# EAGLE design Zio nRF52840 Dev Board (EAGLE 9.2.2)
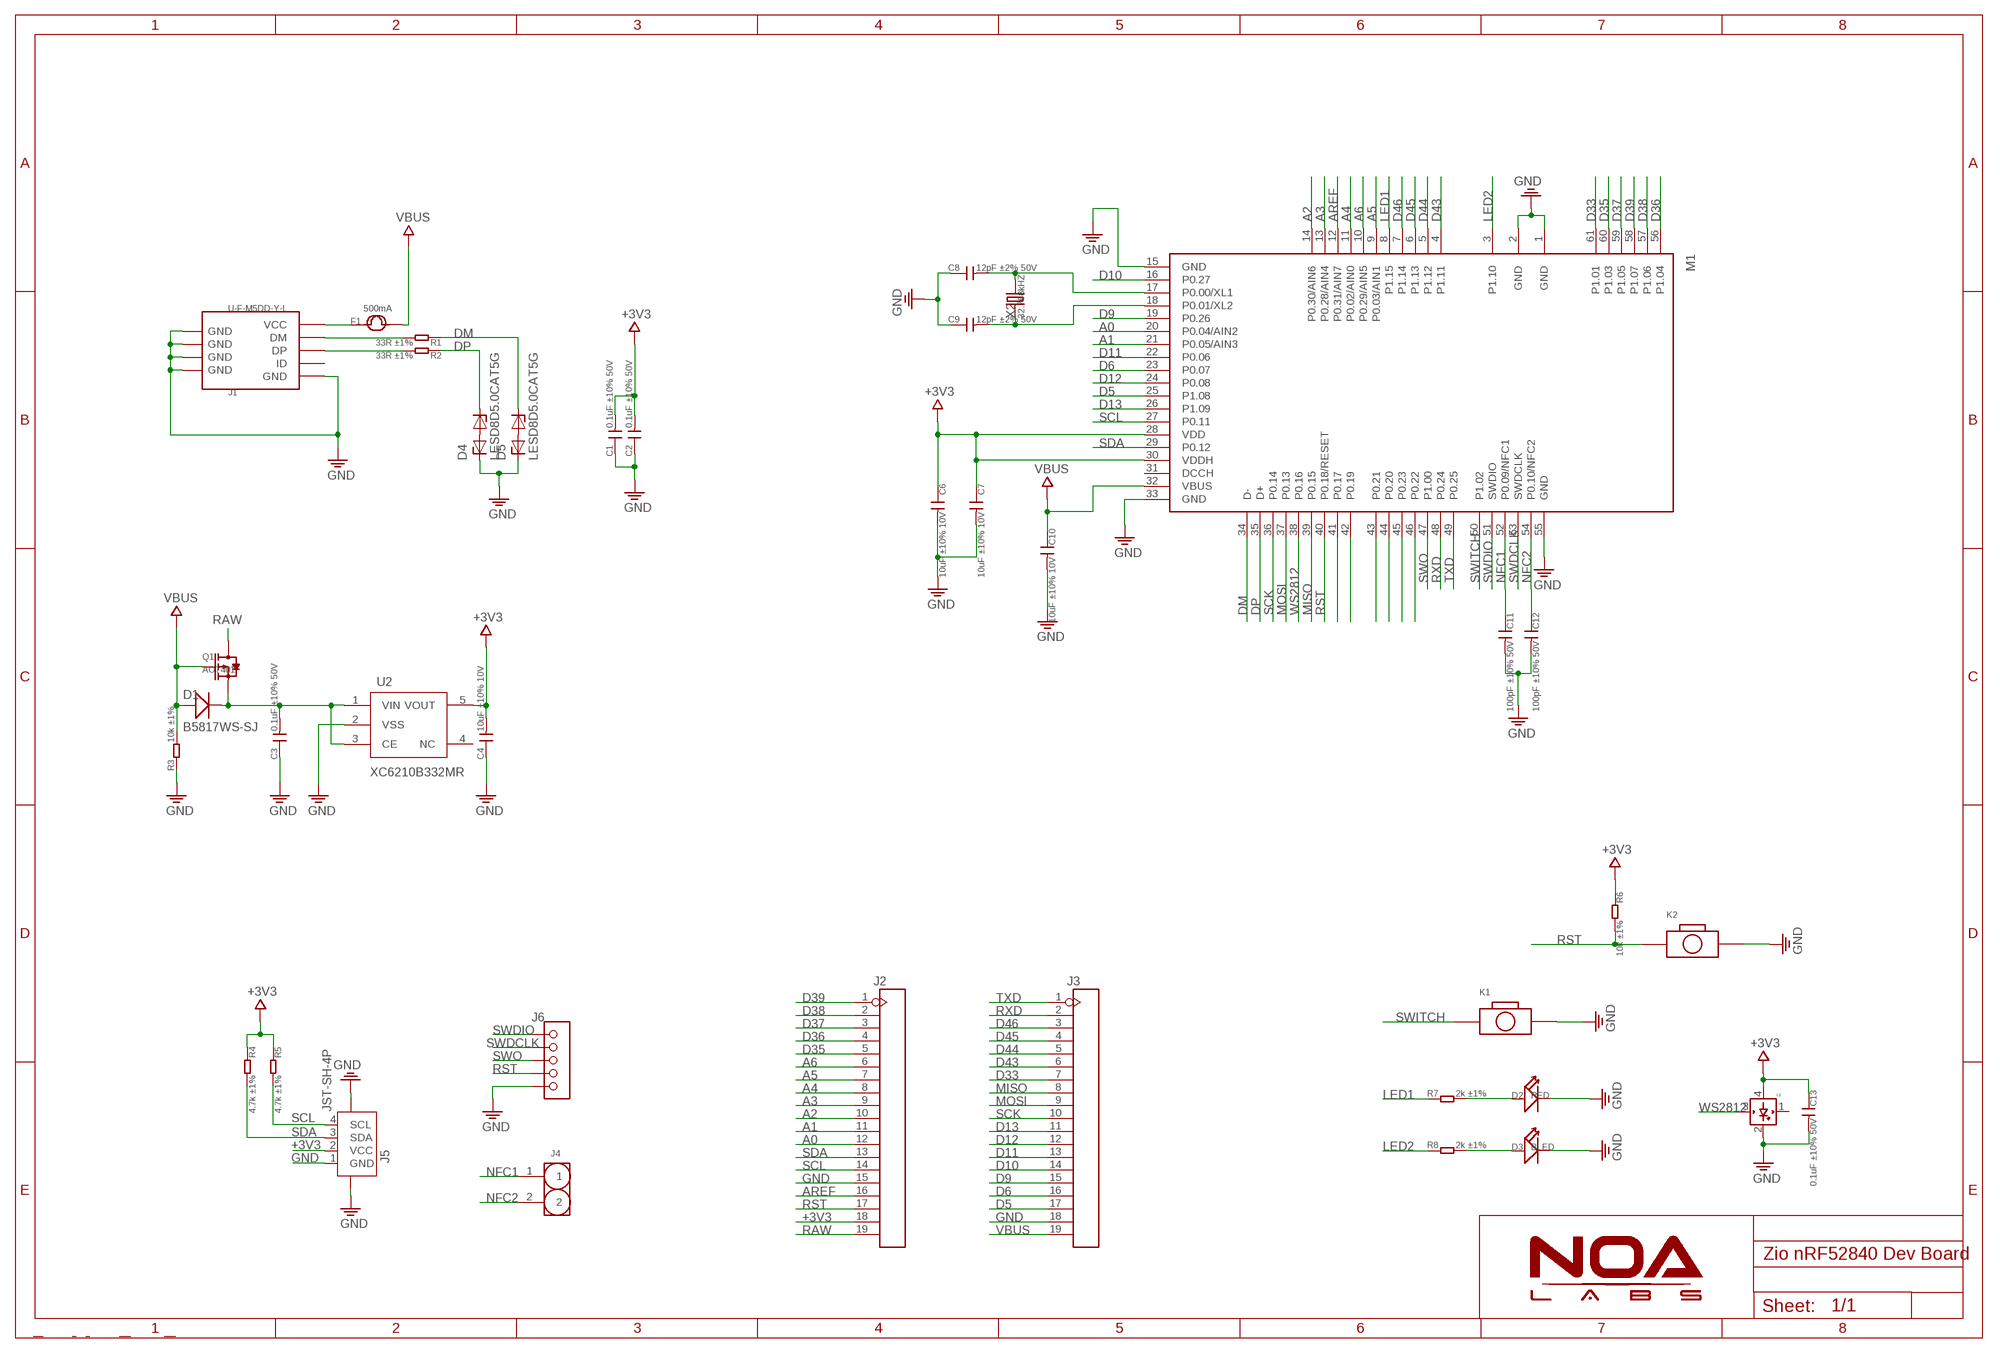
[diagram p0: schematic, sheet 1]

## Parts
C1  0.1uF ±10% 50V  C-0402  [C0402]
C2  0.1uF ±10% 50V  C-0402  [C0402]
C3  0.1uF ±10% 50V  C-0402  [C0402]
C4  10uF ±10% 10V  C-0603  [C0603]
C6  10uF ±10% 10V  C-0603  [C0603]
C7  10uF ±10% 10V  C-0603  [C0603]
C8  12pF ±2% 50V  C-0402  [C0402]
C9  12pF ±2% 50V  C-0402  [C0402]
C10  10uF ±10% 10V  C-0603  [C0603]
C11  100pF ±10% 50V  C-0402  [C0402]
C12  100pF ±10% 50V  C-0402  [C0402]
C13  0.1uF ±10% 50V  C-0402  [C0402]
D1  B5817WS-SJ  D-0805  [SOD323]
D2  RED  LED'0603'  [LED-0603]
D3  BLED  LED'0603'  [LED-0603]
D4  LESD8D5.0CAT5G  PESD5V0F1BL  [SOD882]
D5  LESD8D5.0CAT5G  PESD5V0F1BL  [SOD882]
F1  500mA  FUSE1206  [1206]
J1  U-F-M5DD-Y-L  USB-MICROE  [MICRO-SMD]
J2  HEADER-19P  [19P-2.54]
J3  HEADER-19P  [19P-2.54]
J4  HEADER-2P-65/35MIL  [2P-2.54-65/35MIL]
J5  JST-SH-4P  [JST-SH-4P-90]
J6  HEADER-5P-2.54  [5P-2.54]
K1  BOTTON-2PSKRKAEE020  [SKRKAEE020]
K2  BOTTON-2PSKRKAEE020  [SKRKAEE020]
L1  WS2812B2020  [WS2812_2020]
M1  MDBT50  [MDBT50]
Q1  AO7401  MOSFET-P-323  [SOT-323]
R1  33R ±1%  R-0402  [R0402]
R2  33R ±1%  R-0402  [R0402]
R3  10k ±1%  R-0402  [R0402]
R4  4.7k ±1%  R-0402  [R0402]
R5  4.7k ±1%  R-0402  [R0402]
R6  10k ±1%  R-0402  [R0402]
R7  2k ±1%  R-0402  [R0402]
R8  2k ±1%  R-0402  [R0402]
U2  XC6210B332MR  XC6210  [SOT23-5]
X2  32.768kHZ  CRYSTAL-3215  [2P-SMD-3.2X1.5]

## Nets
+3V3: C1.2 C2.2 C4.2 C6.1 C7.1 C13.1 J2.18 J5.2(VCC) L1.4(VDD) M1.28(VDD) M1.30(VDDH) R4.1 R5.1 R6.1 U2.5(VOUT)
A0: J2.12 M1.20(P0.04/AIN2)
A1: J2.11 M1.21(P0.05/AIN3)
A2: J2.10 M1.14(P0.30/AIN6)
A3: J2.9 M1.13(P0.28/AIN4)
A4: J2.8 M1.11(P0.02/AIN0)
A5: J2.7 M1.9(P0.03/AIN1)
A6: J2.6 M1.10(P0.29/AIN5)
AREF: J2.16 M1.12(P0.31/AIN7)
D5: J3.17 M1.25(P1.08)
D6: J3.16 M1.23(P0.07)
D9: J3.15 M1.19(P0.26)
D10: J3.14 M1.16(P0.27)
D11: J3.13 M1.22(P0.06)
D12: J3.12 M1.24(P0.08)
D13: J3.11 M1.26(P1.09)
D33: J3.7 M1.61(P1.01)
D35: J2.5 M1.60(P1.03)
D36: J2.4 M1.56(P1.04)
D37: J2.3 M1.59(P1.05)
D38: J2.2 M1.57(P1.06)
D39: J2.1 M1.58(P1.07)
D43: J3.6 M1.4(P1.11)
D44: J3.5 M1.5(P1.12)
D45: J3.4 M1.6(P1.13)
D46: J3.3 M1.7(P1.14)
DM: D5.2 M1.34(D-) R1.1
DP: D4.2 M1.35(D+) R2.1
GND: C1.1 C2.1 C3.1 C4.1 C6.2 C7.2 C8.1 C9.1 C10.2 C11.2 C12.2 C13.2 D2.- D3.- D4.1 D5.1 J1.P5(GND) J1.S1(GND) J1.S2(GND) J1.S3(GND) J1.S4(GND) J2.15 J3.18 J5.1(GND) J5.5 J5.6 J6.5 K1.2 K2.2 L1.2(GND) M1.1(GND) M1.2(GND) M1.15(GND) M1.33(GND) M1.55(GND) R3.1 U2.2(VSS)
LED1: M1.8(P1.15) R7.1
LED2: M1.3(P1.10) R8.1
MISO: J3.8 M1.39(P0.15)
MOSI: J3.9 M1.37(P0.13)
N$1: D3.+ R8.2
N$3: J1.P2(DM) R1.2
N$11: D2.+ R7.2
N$53: C8.2 M1.17(P0.00/XL1) X2.2
N$54: F1.1 J1.P1(VCC)
N$55: J1.P3(DP) R2.2
N$59: C9.2 M1.18(P0.01/XL2) X2.1
NFC1: C11.1 J4.1 M1.52(P0.09/NFC1)
NFC2: C12.1 J4.2 M1.54(P0.10/NFC2)
QSPI_CS: M1.44(P0.20)
QSPI_DATA0: M1.41(P0.17)
QSPI_DATA1: M1.46(P0.22)
QSPI_DATA2: M1.45(P0.23)
QSPI_DATA3: M1.43(P0.21)
QSPI_SCK: M1.42(P0.19)
RAW: J2.19 Q1.3(D)
RST: J2.17 J6.4 K2.1 M1.40(P0.18/RESET) R6.2
RXD: J3.2 M1.48(P0.24)
SCK: J3.10 M1.36(P0.14)
SCL: J2.14 J5.4(SCL) M1.27(P0.11) R5.2
SDA: J2.13 J5.3(SDA) M1.29(P0.12) R4.2
SWDCLK: J6.2 M1.53(SWDCLK)
SWDIO: J6.1 M1.51(SWDIO)
SWITCH: K1.1 M1.50(P1.02)
SWO: J6.3 M1.47(P1.00)
TXD: J3.1 M1.49(P0.25)
VBUS: C10.1 D1.+ F1.2 J3.19 M1.32(VBUS) Q1.1(G) R3.2
VIN: C3.2 D1.- Q1.2(S) U2.1(VIN) U2.3(CE)
WS2812: L1.3(DIN) M1.38(P0.16)
Unconnected: J1.P4(ID) L1.1(DOUT) M1.31(DCCH) U2.4(NC)

## Library data of the parts
C1-C4 C6-C13 = RCL:C
D1 = Discrete_NOA:D*
D2 D3 = Discrete_NOA:LED*
D4 D5 = Discrete_NOA:PESD5V0F1BL
F1 = Discrete:FUSE
J1 = Connector_NOA:USB-MICROE
J2 J3 = Connector:HEADER-19P
J4 = Connector_NOA:HEADER-2P
J5 = Connector:JST-SH-4P
J6 = Connector_NOA:HEADER-5P
K1 K2 = Discrete:BOTTON-2P
L1 = Discrete_NOA:WS2812B
M1 = IC_NOA:MDBT50: Raytac Corporation MDBT50 Bluetooth Low Energy Module based on Noridc nRF52840 Source: Raytac datasheet
Q1 = Discrete_NOA:MOSFET-P
R1-R8 = RCL:R
U2 = IC_NOA:XC6210
X2 = Discrete_NOA:CRYSTAL*: CRYSTAL

## Net classes
1 power: width 0.254 mm

## Board
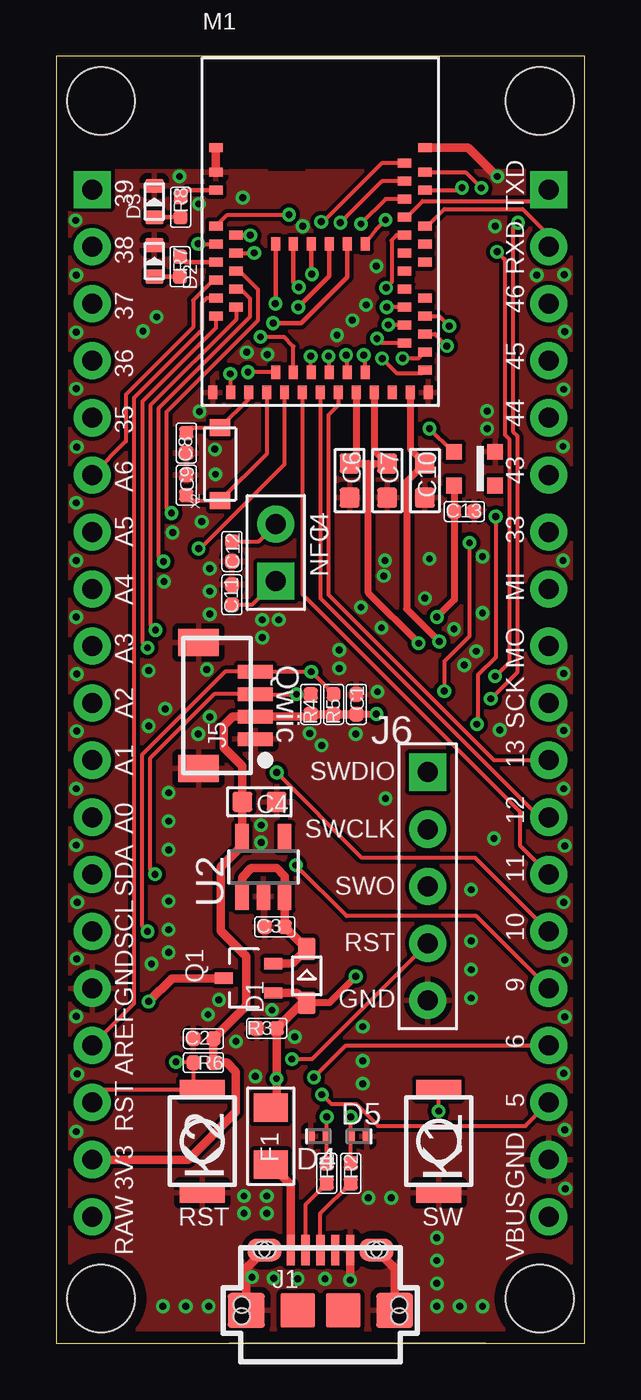
[diagram p1: board, top side]
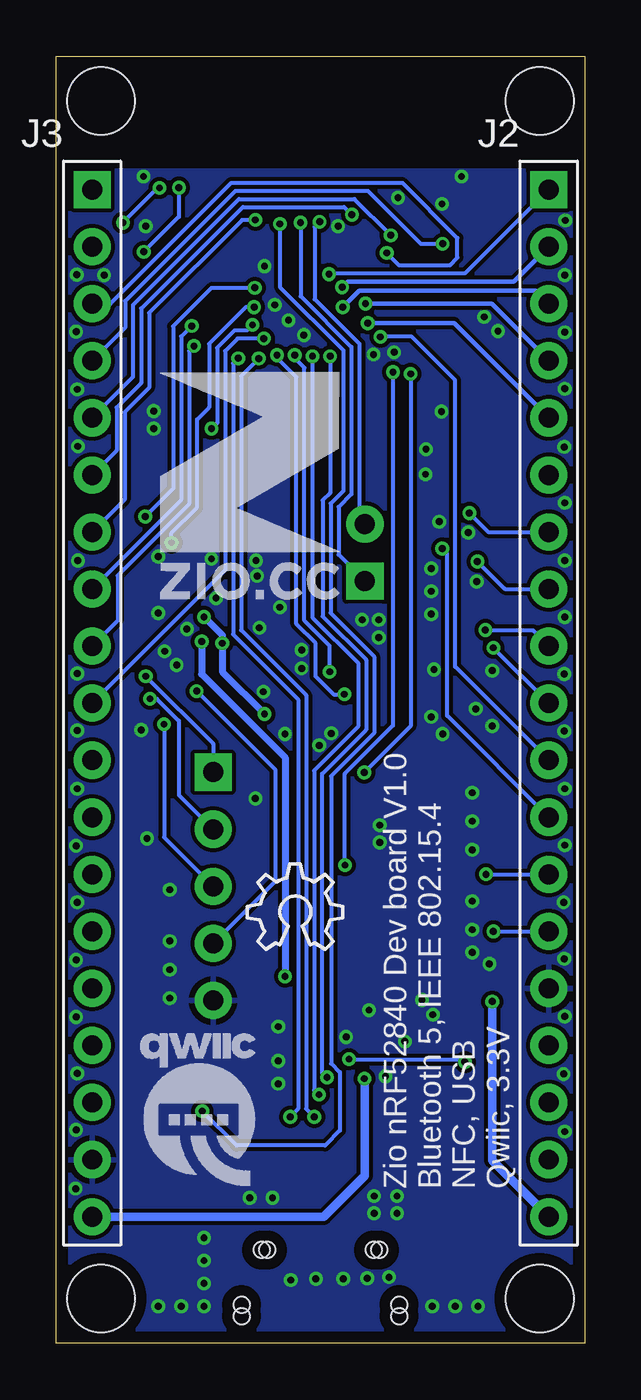
[diagram p2: board, bottom side, seen from below]

Size 23.52 x 57.3 mm. Coordinates in mm from the lower left corner, seen from the top.
Outline: 0,0 23.52,0 23.52,57.3 0,57.3 0,0
Copper layers (1*16): Top 0.035mm / dielectric 1.5mm / Bottom 0.035mm
Design rules "NOA Eagle Rule": minimum track width 7mil, minimum drill 12mil, track to track 7mil, track to pad 7mil, pad to pad 7mil, via to via 7mil, smd to smd 0mil, copper to edge 20mil, drill to drill 10mil, minimum pad ring 10mil, minimum via ring 6mil, stop-mask expansion 2mil, vias tented up to drill 25mil, thermal gap 10mil
Holes 3 mm at 2,55.3 2,2 21.52,2 21.52,55.3

### Footprints (pad centres in the part's own frame; a part is rotated, then mirrored left to right if it is on the bottom)
C0402 = smd 0.635 x 0.635: 1 -0.445,0; 2 0.445,0
C0603 = smd 0.889 x 0.889: 1 -0.762,0; 2 0.762,0
SOD323 = smd 1 x 0.8: + -1.2,0; - 1.2,0
LED-0603 = smd 0.635 x 0.8: + 0.699,0; - -0.699,0
SOD882 = smd 0.4 x 0.7: 1 -0.35,0; 2 0.35,0
1206 = smd 1.27 x 1.524: 1 -1.27,0; 2 1.27,0
MICRO-SMD = smd 0.406 x 1.346: P1 -1.321,2.057; P2 -0.66,2.057; P3 0,2.057; P4 0.66,2.057; P5 1.321,2.057 | smd 1.651 x 1.549: S1 -3.302,-0.635; S2 3.302,-0.635 | smd 1.524 x 1.016: S3 -2.489,2.057; S4 2.489,2.057 | smd 1.524 x 1.524: S5 -1.016,-0.635; S6 1.016,-0.635 | hole 0.7: -3.505,-0.381; -3.505,-0.889; 3.505,-0.381; 3.505,-0.889; -2.616,2.057; -2.362,2.057; 2.362,2.057; 2.616,2.057
19P-2.54 = drill 0.889 pad 1.651 square: 1 0,22.86 | drill 0.889 pad 1.651: 2 0,20.32; 3 0,17.78; 4 0,15.24; 5 0,12.7; 6 0,10.16; 7 0,7.62; 8 0,5.08; 9 0,2.54; 10 0,0; 11 0,-2.54; 12 0,-5.08; 13 0,-7.62; 14 0,-10.16; 15 0,-12.7; 16 0,-15.24; 17 0,-17.78; 18 0,-20.32; 19 0,-22.86
2P-2.54-65/35MIL = drill 0.889 pad 1.651 square: 1 0,1.27 | drill 0.889 pad 1.651: 2 0,-1.27
JST-SH-4P-90 = smd 0.6 x 1.55: 1 -1.5,0; 2 -0.5,0; 3 0.5,0; 4 1.5,0 | smd 1.2 x 1.8: 5 -2.8,2.525; 6 2.8,2.525
5P-2.54 = drill 0.889 pad 1.651 square: 1 0,5.08 | drill 0.889 pad 1.651: 2 0,2.54; 3 0,0; 4 0,-2.54; 5 0,-5.08
SKRKAEE020 = smd 0.87 x 2: 1 -2.3,0; 2 2.3,0
WS2812_2020 = smd 0.7 x 0.7: 1 0.915,-0.75; 2 0.915,0.75; 3 -0.915,0.75; 4 -0.915,-0.75
MDBT50 = smd 0.6 x 0.4: 1 -4.65,3.75; 2 -4.65,2.65; 3 -4.65,1.85; 4 -4.65,0.25; 5 -3.75,-0.15; 6 -4.65,-0.55; 7 -3.75,-0.95; 8 -4.65,-1.35; 9 -3.75,-1.75; 10 -4.65,-2.15; 11 -3.75,-2.55; 12 -4.65,-2.95; 13 -3.75,-3.35; 14 -4.65,-3.75; 34 4.65,-6.15; 35 4.65,-5.35; 36 3.75,-4.95; 37 4.65,-4.55; 38 3.75,-4.15; 39 4.65,-3.75; 40 3.75,-3.35; 41 4.65,-2.95; 42 3.75,-2.55; 43 3.75,-1.75; 44 4.65,-1.35; 45 3.75,-0.95; 46 4.65,-0.55; 47 3.75,-0.15; 48 4.65,0.25; 49 3.75,0.65; 50 3.75,1.45; 51 4.65,1.85; 52 3.75,2.25; 53 4.65,2.65; 54 3.75,3.05; 55 4.65,3.75 | smd 0.4 x 0.6: 15 -4.8,-7.15; 16 -4,-7.15; 17 -3.2,-7.15; 18 -2.4,-7.15; 19 -2,-6.25; 20 -1.6,-7.15; 21 -1.2,-6.25; 22 -0.8,-7.15; 23 -0.4,-6.25; 24 0,-7.15; 25 0.4,-6.25; 26 0.8,-7.15; 27 1.2,-6.25; 28 1.6,-7.15; 29 2,-6.25; 30 2.4,-7.15; 31 3.2,-7.15; 32 4,-7.15; 33 4.8,-7.15; 56 -2,-0.55; 57 -1.2,-0.55; 58 -0.4,-0.55; 59 0.4,-0.55; 60 1.2,-0.55; 61 2,-0.55
SOT-323 = smd 0.5 x 0.8: 1 0.65,0; 2 -0.65,0; 3 0,-2.2
R0402 = smd 0.635 x 0.635: 1 -0.445,0; 2 0.445,0
SOT23-5 = smd 0.6 x 1.2: 1 -0.95,-1.306; 2 0,-1.306; 3 0.95,-1.306; 4 0.95,1.306; 5 -0.95,1.306
2P-SMD-3.2X1.5 = smd 0.762 x 0.9: 1 -1.63,0; 2 1.63,0

### Placement (x,y rotation side)
C1  13.36,28.45 270 top
C2  6.55,13.56 0 top
C3  9.73,18.54 0 top
C4  9.04,24.1 180 top
C6  13.06,38.4 270 top
C7  14.73,38.4 270 top
C8  5.79,40.08 90 top
C9  5.79,38.2 270 top
C10  16.41,38.4 270 top
C11  7.82,33.32 90 top
C12  7.82,35.26 270 top
C13  18.16,37.03 0 top
D1  11.15,16.36 90 top
D2  4.37,48.18 270 top
D3  4.37,50.83 270 top
D4  13.46,9.22 180 top
D5  11.68,9.22 0 top
F1  9.55,9.22 90 top
J1  11.76,2.1 0 top
J2  1.6,28.5 0 bottom
J3  21.92,28.5 0 bottom
J4  9.78,35.2 180 top
J5  8.86,28.4 90 top
J6  16.54,20.35 0 top
K1  17.02,9 270 top
K2  6.5,9 270 top
L1  18.62,38.94 0 top
M1  11.76,49.48 0 top
Q1  9.65,16.26 270 top
R1  12.04,7.57 270 top
R2  13.11,7.57 270 top
R3  9.37,14.02 0 top
R4  11.33,28.45 90 top
R5  12.34,28.45 90 top
R6  6.55,12.5 180 top
R7  5.51,47.93 270 top
R8  5.54,50.57 270 top
U2  9.22,21.21 0 top
U$17  [10MM]  18.9,33.15 0 bottom
U$18  [QWIIC-LOGO-MEDIUM]  17.22,10.46 0 bottom
U$19  [OSHW_6X150_NOTEXT]  15.01,17.53 0 bottom
X2  7.29,39.14 90 top

### Tracks (layer width: path | path; a pad name or v marks a point on that pad's centre or on a via)
+3V3  (via drill 0.3)
  Top 0.305: M1.28 13.36,39.47 C6.1 13.61,39.17 | M1.30 14.16,39.74 C7.1 14.17,39.17 | 13.61,39.17 13.89,39.17 | 13.89,39.17 14.17,39.17 | L1.4 17.7,37.05 C13.1 17.72,33.11 v16.94,32.33 | v14.25,28.02 14.24,28 C1.2 | v16.13,31.17 13.89,33.4 13.89,38.89 | 13.89,38.89 13.89,39.17 | 13.89,38.89 13.61,39.17 | 13.89,38.89 14.17,39.17
  Top 0.381: C1.2 R5.1 R4.1 11.22,27.9 J5.2 7.86,27.9 7.47,27.51 7.47,26.52 8.28,25.7 C4.2 U2.5 8.27,22.16 7.32,21.21 7.32,18.36 8.46,17.22 8.46,15.02 C2.2 R6.1 7.59,12.5 8,12.09 8,10.31 5.87,8.18 J2.18
  Bottom 0.305: v14.25,28.02 16.13,29.9 v16.13,31.17 16.13,31.52 v16.94,32.33
A0  (via drill 0.3)
  Top 0.178: M1.20 10.16,39.13 6.41,35.38 v6.34,35.38
  Bottom 0.178: J2.12 6.12,27.94 6.12,35.17 v6.34,35.38
A1  (via drill 0.3)
  Top 0.178: M1.21 10.56,44.38 10.13,44.81 v9.09,44.81
  Bottom 0.178: J2.11 5.77,30.13 5.77,42.88 7.7,44.81 v9.09,44.81
A2  (via drill 0.3)
  Top 0.178: M1.14 7.11,45.2 3.83,41.93 3.83,31.19 v4.06,30.96
  Bottom 0.178: J2.10 v4.06,30.96
A3  (via drill 0.3)
  Top 0.178: M1.13 8.01,45.58 4.19,41.76 4.19,31.98 v4.42,31.75
  Bottom 0.178: v4.42,31.75 2.31,31.75 J2.9
A4  (via drill 0.3)
  Top 0.178: M1.11 8.21,46.93 8.61,46.53 8.61,45.67 4.55,41.61 4.55,35.03 v4.78,34.8
  Bottom 0.178: v4.78,34.8 3.56,33.58 J2.8
A5  (via drill 0.3)
  Top 0.178: M1.9 8.17,47.73 8.97,46.94 8.97,45.53 4.9,41.46 4.9,37.19 v5.13,36.96
  Bottom 0.178: v5.13,36.96 4.29,36.12 J2.7
A6
  Top 0.178: M1.10 7,47.33 6.1,46.43 6.1,45.23 3.1,42.23 3.1,40.16 J2.6
AREF
  Top 0.178: M1.12 6.7,46.53 6.5,46.33 6.5,45.13 3.45,42.09 3.45,15.11 J2.16
D5  (via drill 0.3)
  Top 0.178: M1.25 12.16,43.9 v12.12,43.94 | v11.82,11.07 12.24,10.65 13.34,10.65 14.32,9.68 20.88,9.68 J3.17
  Bottom 0.178: v12.12,43.94 12.12,32.32 10.08,30.29 10.08,27.46 12.04,25.5 12.04,11.28 12.03,11.28 v11.82,11.07
D6  (via drill 0.3)
  Top 0.178: M1.23 11.33,43.27 v11.33,43.94 | v11.47,11.84 12.89,13.26 J3.16
  Bottom 0.178: v11.33,43.94 11.33,37.86 11.66,37.53 11.66,32.37 9.73,30.43 9.73,27.31 11.68,25.35 11.68,12.05 v11.47,11.84
D9  (via drill 0.3)
  Top 0.178: M1.19 v8.54,43.23 v8.53,43.23 | J3.15 18.7,19.02 12.93,19.02 v10.67,21.29
  Bottom 0.178: v8.53,43.23 8.53,27.5 10.67,25.36 v10.67,21.29
D10  (via drill 0.3)
  Top 0.178: M1.16 v7.76,43.14 v7.75,43.16 | J3.14 18.64,21.61 13.61,21.61 v9.81,25.41
  Bottom 0.178: v7.75,43.16 7.75,27.48 v9.81,25.41
D11
  Top 0.178: M1.22 10.96,33.35 20.65,23.66 20.65,22.15 J3.13
D12
  Top 0.178: M1.24 11.76,33.2 11.79,33.17 11.76,33.17 21.51,23.42 J3.12
D13
  Top 0.178: M1.26 12.56,41.77 12.12,41.33 12.12,33.33 19.48,25.96 J3.11
D33  (via drill 0.3)
  Top 0.178: v14.66,50.01 14.25,49.61 13.76,48.98 M1.61
  Bottom 0.178: v14.66,50.01 15.24,50.01 19.38,45.87 19.38,42.55 20.47,41.45 20.47,37.57 J3.7
D35  (via drill 0.3)
  Top 0.203: M1.60 12.96,47.46 10.91,45.41 v9.65,45.41
  Bottom 0.203: J2.5 5.82,45.41 v9.65,45.41
D36  (via drill 0.3)
  Top 0.203: M1.56 9.76,46.61 v9.75,46.28
  Bottom 0.203: v9.75,46.28 4.14,46.28 J2.4
D37  (via drill 0.3)
  Top 0.203: M1.59 12.16,47.52 v10.77,46.13
  Bottom 0.203: J2.3 2.18,46.86 10.03,46.86 v10.77,46.13
D38  (via drill 0.3)
  Top 0.203: v10.79,47.02 10.56,47.25 M1.57
  Bottom 0.203: v10.79,47.02 10.54,47.27 3.15,47.27 J2.2
D39  (via drill 0.3)
  Top 0.203: v11.38,47.6 11.36,47.62 M1.58
  Bottom 0.178: J2.1 5.31,47.65 11.33,47.65 v11.38,47.6
D43  (via drill 0.3)
  Top 0.178: M1.4 7.62,50.24 v10.36,50.24
  Bottom 0.178: v10.36,50.24 10.7,50.59 15.21,50.59 19.74,46.07 19.74,42.75 20.83,41.66 20.83,39.75 J3.6
D44  (via drill 0.3)
  Top 0.178: M1.5 v8.64,49.33
  Bottom 0.178: J3.5 20.09,43.03 20.09,46.24 15.39,50.94 10.25,50.94 v8.64,49.33
D45  (via drill 0.3)
  Top 0.178: v6.33,48.95 6.34,48.93 M1.6
  Bottom 0.178: J3.4 20.45,45.21 20.45,46.4 15.54,51.31 9.65,51.31 7.29,48.95 v6.33,48.95
D46  (via drill 0.3)
  Top 0.178: M1.7 v8.81,48.53 v8.81,48.54
  Bottom 0.178: J3.3 21.11,46.28 15.72,51.66 8.13,51.66 5.66,49.2 5.66,48.34 5.99,48.01 8.28,48.01 v8.81,48.54
DM  (via drill 0.3)
  Top 0.178: R1.1 D5.2 v12.03,10.08 v12.04,10.08 | v14.5,43.84 15.16,43.18 16.26,43.18 M1.34
  Bottom 0.178: v12.04,10.08 12.39,10.44 12.39,28.85 15.29,31.75 15.29,43.05 v14.5,43.84
DP  (via drill 0.3)
  Top 0.178: R2.1 D4.2 v13.11,10.08 | v15.42,43.85 16.13,43.85 M1.35
  Bottom 0.178: v13.11,10.08 12.75,10.44 12.75,28.66 15.65,31.56 15.65,43.62 v15.42,43.85
GND  (via drill 0.3)
  Top 0.381: M1.55 18.34,53.23 v19.63,51.94 | M1.1 M1.2 | J1.S1 8.46,3.35 J1.S3 | J1.S4 15.06,3.35 J1.S2 | J1.P5 v13.08,2.82
  other vias: 8.31,51 5.49,51.94 6.35,50.72 0.89,47.55 0.89,45.01 4.47,45.69 5.18,36.09 6.48,36.58 4.8,33.91 4.11,29.95 0.89,37.41 0.91,39.9 0.89,42.49 8.48,44.12 7.06,39.8 7.09,38.68 9.4,44.02 6.38,41.48 22.61,47.57 0.89,9.42 8,13.44 9.6,14.83 7.24,15.29 6.76,14.63 10.62,13.64 22.58,12.01 22.63,17.07 22.58,19.63 22.58,24.69 22.58,27.28 11.28,27.15 13.34,27.13 11.81,26.62 14.3,29.01 18.97,32.51 22.58,29.82 18.69,30.81 18.16,30.2 16.61,34.92 16.41,33.17 21.39,47.55 19.53,49.73 10.97,49.73 22.63,45.03 22.58,42.47 22.56,39.93 19.18,40.72 19.18,41.5 22.56,34.85 13.56,32.77 14.63,34.85 14.58,34.16 14.48,31.85 18.97,35.03 12.6,30.86 12.6,30.05 4.85,28.24 0.89,24.69 9.17,32.21 9.91,32.21 9.17,31.42 22.63,14.53 22.63,22.15 8.71,2.95 9.68,2.9 10.74,2.87 11.96,2.87 8.36,6.55 9.37,6.55 8.36,5.79 9.37,5.79 8.86,11.89 9.12,23.06 9.12,22.3 6.32,27.13 6.83,27.89 6.83,32.46 6.83,33.48 6.83,34.49 0.86,49.99 18.47,20.19 18.47,17.91 18.47,16.64 18.47,15.37 19.48,22.48 14.66,24.26 19.74,27.3 4.24,16.89 5,17.4 5,18.41 5,19.68 5,21.97 5,23.24 5,24.51 13.64,12.57 13.64,11.56 13.64,14.1 13.89,6.48 14.91,6.48 16.94,4.7 16.94,3.68 16.94,2.67 16.94,1.65 6.78,1.65 5.77,1.65 4.75,1.65 17.96,1.65 18.97,1.65 0.89,34.85 0.89,32.33 0.91,29.79 0.91,27.25 0.89,22.17 0.94,19.63 0.91,17.12 0.89,14.55 22.63,9.5 22.66,6.88 0.94,11.99 12.5,44.88 13.18,45.54 13.79,46.23 14.25,47.96 3.86,45.06 6.71,30 4.11,27.48 17.7,31.8
  pour Bottom: 0,52.2 6.55,52.2 19.28,52.2 23.52,52.2 23.52,0 0,0
  pour Top: 0,52.2 10.11,52.2 12.73,52.2 23.52,52.2 23.52,0 0,0
LED1
  Top 0.203: M1.8 5.75,48.13 R7.1
LED2
  Top 0.203: M1.3 5.86,51.33 R8.1
MISO  (via drill 0.3)
  Top 0.178: M1.39 17.04,45.73 v17.49,45.29
  Bottom 0.178: v17.49,45.29 17.96,44.82 17.96,37.54 J3.8
MOSI  (via drill 0.3)
  Top 0.178: M1.37 16.85,44.93 v17.39,44.4
  Bottom 0.178: v17.39,44.4 17.6,44.18 17.6,37.36 20.79,34.17 20.79,32.17 J3.9
N$1
  Top 0.203: R8.2 D3.+
N$3
  Top 0.178: J1.P2 11.1,6.18 R1.2
N$11
  Top 0.203: R7.2 D2.+
N$53
  Top 0.178: C8.2 6.04,40.77 X2.2 8.56,42.04 M1.17
N$54
  Top 0.381: J1.P1 10.44,7.06 F1.1
N$55
  Top 0.178: J1.P3 11.76,5.78 R2.2
N$59
  Top 0.178: C9.2 6.04,37.51 X2.1 9.36,39.58 M1.18
NFC1  (via drill 0.3)
  Top 0.178: v12.65,49.89 14.49,51.73 M1.52 | C11.1 8.72,32.88 J4.1
  Bottom 0.178: v12.65,49.89 12.65,46.61 10.39,44.35 10.39,37.8 10.95,37.24 10.95,35.1 J4.1
NFC2  (via drill 0.3)
  Top 0.178: M1.54 14.48,52.53 11.88,49.93 v11.8,49.93 | C12.1 9,35.7 J4.2
  Bottom 0.178: v11.8,49.93 12.01,49.71 12.01,46.48 10.03,44.5 10.03,36.73 J4.2
RAW  (via drill 0.3)
  Top 0.381: Q1.3 5.16,16.26 v4.12,15.21
  Bottom 0.381: v4.12,15.21 4.12,8.15 J2.19
RST  (via drill 0.3)
  Top 0.178: J2.17 2.18,11.3 6.35,11.3 | 6.35,11.3 K2.1 | 6.35,11.3 6.11,11.54 R6.2 5.36,12.5 v5.33,12.52 | M1.40 v14.72,46.13 v14.71,46.13 | v18.39,35.64 18.39,31.47 17.27,30.35 v17.27,29.03 | J6.4 11.38,12.65 v10.49,12.65
  Bottom 0.178: v14.71,46.13 15.09,46.13 16.71,44.5 16.71,41.66 17.25,41.12 17.25,37.22 18.39,36.07 v18.39,35.64 | v17.27,29.03 13.75,25.51 13.75,20.59 J6.4 | v10.49,12.65 5.46,12.65 v5.33,12.52
RXD
  Top 0.178: M1.48 16.51,49.73 17.27,50.49 20.75,50.49 21.92,49.33 J3.2
SCK  (via drill 0.3)
  Top 0.178: M1.36 14.47,44.53 v14.28,44.73
  Bottom 0.178: v14.28,44.73 15.44,44.73 16,44.17 16,34.42 J3.10
SCL  (via drill 0.3)
  Top 0.178: v4.06,18.34 3.81,18.59 3.81,26.19 7.52,29.9 J5.4 v11.35,29.9 12.34,28.91 R5.2 | M1.27 12.96,43.94 v12.9,43.99
  Bottom 0.178: v4.06,18.34 J2.14 | v12.9,43.99 12.9,43.87 12.47,43.43 12.47,32.17 11.35,31.05 v11.35,29.9
SDA  (via drill 0.3)
  Top 0.178: v4.39,20.88 4.17,21.11 4.17,26.04 7.03,28.9 J5.3 v10.69,28.89 R4.2 | M1.29 13.76,43.92 v13.69,43.99
  Bottom 0.178: v4.39,20.88 J2.13 | v13.69,43.99 13.69,43.87 12.83,43 12.83,32.02 11.97,31.17 11.97,29.69 11.18,28.89 v10.69,28.89
SWDCLK  (via drill 0.3)
  Top 0.178: M1.53 18.22,52.13 v18.92,51.44 | v20.55,49.89 20.32,49.66 20.32,40.6 20.51,40.41 20.51,29.86 v19.34,28.69
  Bottom 0.178: v20.55,49.89 19,51.44 v18.92,51.44 | v19.34,28.69 19.04,28.69 18.06,27.71 18.06,24.41 J6.2
SWDIO  (via drill 0.3)
  Top 0.178: M1.51 17.95,51.33 v18.06,51.45 | v19.53,29.69 20.16,30.32 20.16,40.26 19.96,40.45 19.96,48.25 v19.62,48.59
  Bottom 0.178: v18.06,51.45 18.06,50.15 v19.62,48.59 | J6.1 16.54,26.7 v19.53,29.69
SWITCH  (via drill 0.3)
  Top 0.178: v13.56,49.84 14.66,50.93 M1.50 | v17.02,10.34 K1.1
  Bottom 0.178: v13.56,49.84 13.56,47.03 10.74,44.21 10.74,37.94 11.3,37.38 11.3,32.51 9.37,30.58 9.37,27.16 11.28,25.25 11.28,12.46 10.9,12.07 10.9,9.47 11.56,8.81 15.49,8.81 v17.02,10.34
SWO  (via drill 0.3)
  Top 0.178: M1.47 15.15,49.33 14.93,49.1 14.93,47.23 v14.68,46.99 | v19.56,36.8 19.56,30.53 18.77,29.74 18.77,27.61 v18.72,27.56
  Bottom 0.178: v14.68,46.99 16.59,46.99 18.31,45.27 18.31,38.05 v19.56,36.8 | v18.72,27.56 18.72,22.53 J6.3
TXD
  Top 0.178: M1.49 15.59,50.13 16.31,50.85 21.41,50.85 J3.1
VBUS  (via drill 0.3)
  Top 0.305: M1.32 15.76,39.81 C10.1 15.6,38.35 15.6,32.69 v17.04,31.24 | v13.34,16.33 12.16,15.16 D1.+
  Top 0.381: F1.2 9.8,10.74 v9.8,11.79 9.8,14.01 R3.2 10.95,15.16 D1.+ 10.7,15.61 Q1.1
  Bottom 0.305: v17.04,31.24 17.04,29.79 13.34,26.09 v13.34,16.33
  Bottom 0.381: J3.19 11.61,5.64 9.78,7.47 9.78,11.76 v9.8,11.79
VIN
  Top 0.381: Q1.2 10.5,16.91 D1.- C3.2 U2.3 10.17,20.79 9.8,21.16 8.69,21.16 8.27,20.74 U2.1
WS2812  (via drill 0.3)
  Top 0.178: M1.38 v14.79,45.33 v14.78,45.34 | L1.3 17.64,39.69 v16.61,40.72
  Bottom 0.178: v14.78,45.34 15.04,45.09 15.59,45.09 16.36,44.32 16.36,40.97 v16.61,40.72

### Text on the board
tPlace: TXD | 39 | RXD | 38 | 46 | 37 | 45 | 36 | 44 | 35 | 43 | A6 | 33 | NFC | A5 | MI | A4 | MO | A3 | Qwiic | SCK | A2 | 13 | SWDIO | A1 | 12 | A0 | SWCLK | 11 | SWO | SDA | 10 | SCL | RST | GND | 9 | GND | 6 | AREF | 5 | RST | GND | 3V3 | VBUS | RST | SW | RAW
bPlace: Zio nRF52840 Dev board V1.0 / Bluetooth 5, IEEE 802.15.4 / NFC, USB / Qwiic, 3.3V